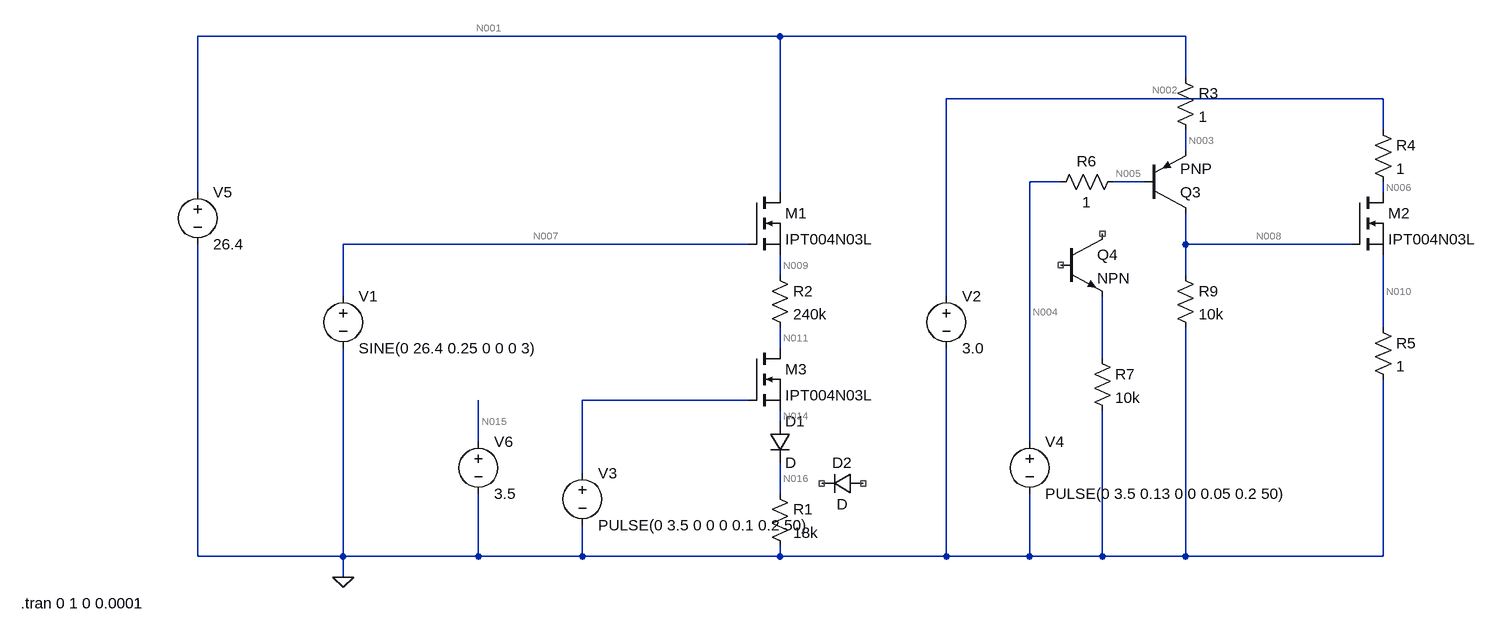
[diagram p0: schematic VoltSampleSim_V2.asc]
VoltSampleSim_V2.asc, the LTspice schematic file:
Version 4
SHEET 1 1572 680
WIRE 192 -304 -704 -304
WIRE 816 -304 192 -304
WIRE 816 -240 816 -304
WIRE 1120 -208 448 -208
WIRE 1120 -160 1120 -208
WIRE 816 -128 816 -160
WIRE 624 -80 576 -80
WIRE 752 -80 704 -80
WIRE -704 -64 -704 -304
WIRE 192 -64 192 -304
WIRE 1120 -64 1120 -80
WIRE 144 16 -480 16
WIRE 816 16 816 -32
WIRE 1072 16 816 16
WIRE 192 64 192 32
WIRE 816 64 816 16
WIRE -480 96 -480 16
WIRE 448 96 448 -208
WIRE 1120 144 1120 32
WIRE 192 176 192 144
WIRE 688 192 688 96
WIRE 144 256 -112 256
WIRE 192 288 192 272
WIRE -272 320 -272 256
WIRE 576 320 576 -80
WIRE -112 368 -112 256
WIRE 192 400 192 352
WIRE -704 496 -704 16
WIRE -480 496 -480 176
WIRE -480 496 -704 496
WIRE -272 496 -272 400
WIRE -272 496 -480 496
WIRE -112 496 -112 448
WIRE -112 496 -272 496
WIRE 192 496 192 480
WIRE 192 496 -112 496
WIRE 448 496 448 176
WIRE 448 496 192 496
WIRE 576 496 576 400
WIRE 576 496 448 496
WIRE 688 496 688 272
WIRE 688 496 576 496
WIRE 816 496 816 144
WIRE 816 496 688 496
WIRE 1120 496 1120 224
WIRE 1120 496 816 496
WIRE -480 528 -480 496
FLAG -480 528 0
SYMBOL voltage -480 80 R0
WINDOW 123 0 0 Left 0
WINDOW 39 0 0 Left 0
SYMATTR InstName V1
SYMATTR Value SINE(0 26.4 0.25 0 0 0 3)
SYMBOL res 176 384 R0
SYMATTR InstName R1
SYMATTR Value 18k
SYMBOL res 176 48 R0
SYMATTR InstName R2
SYMATTR Value 240k
SYMBOL nmos 144 -64 R0
SYMATTR InstName M1
SYMATTR Value IPT004N03L
SYMBOL voltage 448 80 R0
WINDOW 123 0 0 Left 0
WINDOW 39 0 0 Left 0
SYMATTR InstName V2
SYMATTR Value 3.0
SYMBOL voltage 576 304 R0
WINDOW 123 0 0 Left 0
WINDOW 39 0 0 Left 0
SYMATTR InstName V4
SYMATTR Value PULSE(0 3.5 0.13 0 0 0.05 0.2 50)
SYMBOL pnp 752 -32 M180
SYMATTR InstName Q3
SYMBOL npn 624 0 R0
SYMATTR InstName Q4
SYMBOL res 800 48 R0
SYMATTR InstName R9
SYMATTR Value 10k
SYMBOL nmos 1072 -64 R0
SYMATTR InstName M2
SYMATTR Value IPT004N03L
SYMBOL voltage -704 -80 R0
WINDOW 123 0 0 Left 0
WINDOW 39 0 0 Left 0
SYMATTR InstName V5
SYMATTR Value 26.4
SYMBOL res 672 176 R0
SYMATTR InstName R7
SYMATTR Value 10k
SYMBOL nmos 144 176 R0
SYMATTR InstName M3
SYMATTR Value IPT004N03L
SYMBOL voltage -112 352 R0
WINDOW 123 0 0 Left 0
WINDOW 39 0 0 Left 0
SYMATTR InstName V3
SYMATTR Value PULSE(0 3.5 0 0 0 0.1 0.2 50)
SYMBOL voltage -272 304 R0
WINDOW 123 0 0 Left 0
WINDOW 39 0 0 Left 0
SYMATTR InstName V6
SYMATTR Value 3.5
SYMBOL diode 176 288 R0
SYMATTR InstName D1
SYMBOL diode 320 368 R90
WINDOW 0 0 32 VBottom 2
WINDOW 3 32 32 VTop 2
SYMATTR InstName D2
SYMBOL res 800 -256 R0
SYMATTR InstName R3
SYMATTR Value 1
SYMBOL res 1104 -176 R0
SYMATTR InstName R4
SYMATTR Value 1
SYMBOL res 1104 128 R0
SYMATTR InstName R5
SYMATTR Value 1
SYMBOL res 720 -96 R90
WINDOW 0 0 56 VBottom 2
WINDOW 3 32 56 VTop 2
SYMATTR InstName R6
SYMATTR Value 1
TEXT -976 568 Left 2 !.tran 0 1 0 0.0001

The netlist it stands for:
* VoltSampleSim_V2.asc
V1 N007 0 SINE(0 26.4 0.25 0 0 0 3)
R1 N016 0 18k
R2 N009 N011 240k
M1 N001 N007 N009 N009 IPT004N03L
V2 N002 0 3.0
V4 N004 0 PULSE(0 3.5 0.13 0 0 0.05 0.2 50)
Q3 N008 N005 N003 0 PNP
Q4 NC_01 NC_02 N012 0 NPN
R9 N008 0 10k
M2 N006 N008 N010 N010 IPT004N03L
V5 N001 0 26.4
R7 N012 0 10k
M3 N011 N013 N014 N014 IPT004N03L
V3 N013 0 PULSE(0 3.5 0 0 0 0.1 0.2 50)
V6 N015 0 3.5
D1 N014 N016 D
D2 NC_03 NC_04 D
R3 N001 N003 1
R4 N002 N006 1
R5 N010 0 1
R6 N005 N004 1
.model D D
.lib standard.dio
.model NPN NPN
.model PNP PNP
.lib standard.bjt
.model NMOS NMOS
.model PMOS PMOS
.lib standard.mos
.tran 0 1 0 0.0001
.backanno
.end

* Results of the author's LTspice run, read from the files saved beside the schematic
* Operating Point, zero values left out:
*   V(n016) = 4.518 µV
*   V(n009) = 10.66 V
*   V(n011) = 10.66 V
*   V(n001) = 26.4 V
*   V(n002) = 3 V
*   V(n008) = 13.7 V
*   V(n005) = 12.68 V
*   V(n003) = 13.72 V
*   V(n006) = 1.5 V
*   V(n010) = 1.5 V
*   V(n014) = 262 mV
*   V(n015) = 3.5 V
*   Ic(Q3) = -1.37 mA
*   Ib(Q3) = -12.68 A
*   Ie(Q3) = 12.68 A
*   Id(M3) = 236.8 pA
*   Is(M3) = -236.8 pA
*   Id(M2) = 1.5 A
*   Is(M2) = -1.5 A
*   Id(M1) = 236.8 pA
*   Is(M1) = -236.8 pA
*   I(D1) = 251 pA
*   I(R6) = 12.68 A
*   I(R5) = 1.5 A
*   I(R4) = 1.5 A
*   I(R3) = 12.68 A
*   I(R9) = 1.37 mA
*   I(R2) = 258.1 pA
*   I(R1) = 251 pA
*   I(V5) = -12.68 A
*   I(V4) = 12.68 A
*   I(V2) = -1.5 A
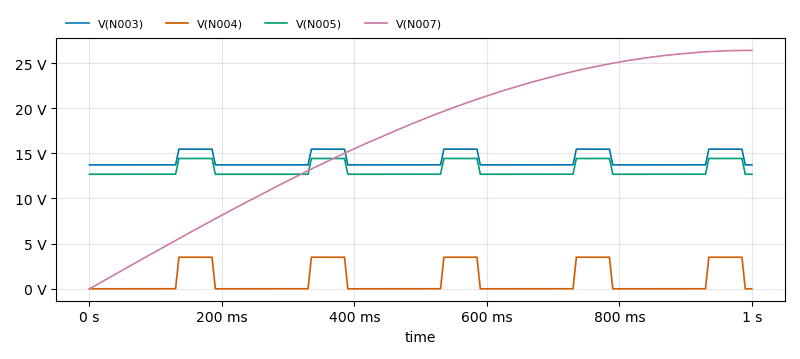
[diagram p1: Transient Analysis of VoltSampleSim_V2.asc, plotted from the saved traces]
* Transient Analysis, 1 run:
*   V(N003): min 13.72 V, max 15.47 V, average 14.2 V, rms 14.22 V, last 13.72 V
*   V(N004): min 0 V, max 3.5 V, average 962.5 mV, rms 1.821 V, last 0 V
*   V(N005): min 12.68 V, max 14.43 V, average 13.16 V, rms 13.19 V, last 12.68 V
*   V(N007): min 0 V, max 26.4 V, average 16.8 V, rms 18.67 V, last 26.4 V